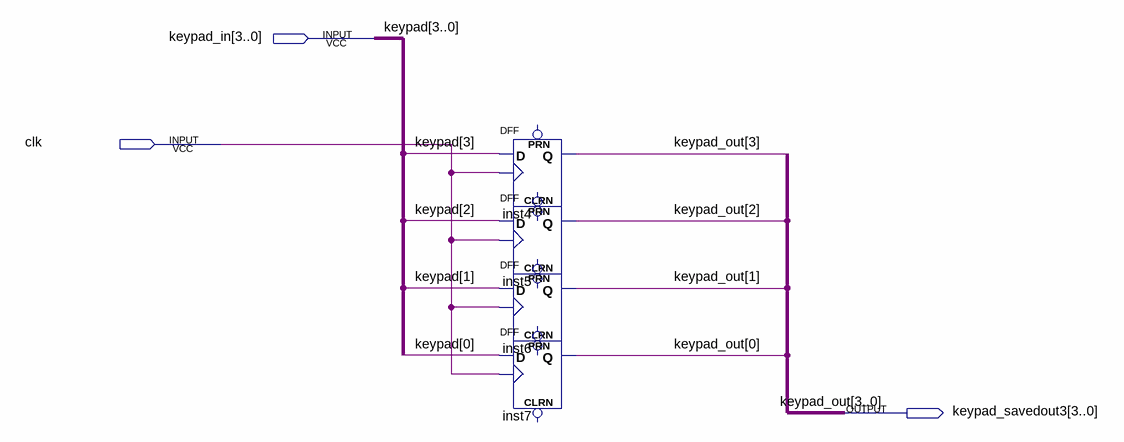
[diagram p0: schematic sheet]
// Quartus schematic register.bdf as structural Verilog: 4 symbols, 3 pins
module register (
  input  [3:0] keypad_in,
  input  clk,
  output [3:0] keypad_savedout3
);

  DFF inst4 (.CLK(clk), .D(keypad_in[3]), .Q(keypad_savedout3[3]));  // open: CLRN, PRN
  DFF inst5 (.CLK(clk), .D(keypad_in[2]), .Q(keypad_savedout3[2]));  // open: CLRN, PRN
  DFF inst6 (.CLK(clk), .D(keypad_in[1]), .Q(keypad_savedout3[1]));  // open: CLRN, PRN
  DFF inst7 (.CLK(clk), .D(keypad_in[0]), .Q(keypad_savedout3[0]));  // open: CLRN, PRN

  // Other names for the same wires on the sheet: keypad[3:0] = keypad_in; keypad_out[3:0] = keypad_savedout3
endmodule
